# EAGLE schematic box'.bak (EAGLE 6.4)
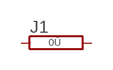
[diagram p0: schematic, sheet 1]

## Parts
J1  0R  [0R/10]
Unconnected: J1.1 J1.2

## Library data of the parts
J1 = jumper:0R: Bridge 0R 10mm

## Net classes
0 default: width 0.203 mm